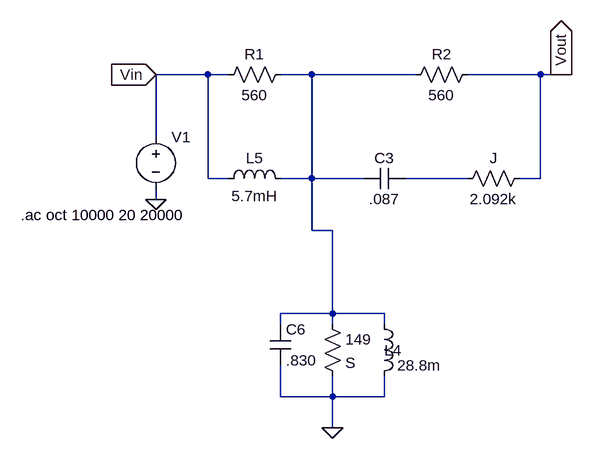
[diagram p0: schematic HiLoCut.asc]
HiLoCut.asc, the LTspice schematic file:
Version 4
SHEET 1 880 680
WIRE 192 112 112 112
WIRE 224 112 192 112
WIRE 352 112 304 112
WIRE 512 112 352 112
WIRE 704 112 592 112
WIRE 736 112 704 112
WIRE 752 112 736 112
WIRE 112 208 112 112
WIRE 192 272 192 112
WIRE 224 272 192 272
WIRE 352 272 352 112
WIRE 352 272 304 272
WIRE 432 272 352 272
WIRE 592 272 496 272
WIRE 704 272 704 112
WIRE 704 272 672 272
WIRE 112 304 112 288
WIRE 352 352 352 272
WIRE 384 352 352 352
WIRE 384 480 384 352
WIRE 384 480 304 480
WIRE 464 480 384 480
WIRE 304 496 304 480
WIRE 384 496 384 480
WIRE 464 496 464 480
WIRE 304 608 304 560
WIRE 384 608 384 576
WIRE 384 608 304 608
WIRE 464 608 464 576
WIRE 464 608 384 608
WIRE 384 656 384 608
FLAG 736 112 Vout
IOPIN 736 112 Out
FLAG 112 112 Vin
IOPIN 112 112 In
FLAG 384 656 0
FLAG 112 304 0
SYMBOL voltage 112 192 R0
SYMATTR InstName V1
SYMATTR Value ""
SYMATTR Value2 AC 1
SYMBOL Res 320 96 R90
WINDOW 0 0 56 VBottom 2
WINDOW 3 32 56 VTop 2
SYMATTR InstName R1
SYMATTR Value 560
SYMBOL Res 608 96 R90
WINDOW 0 0 56 VBottom 2
WINDOW 3 32 56 VTop 2
SYMATTR InstName R2
SYMATTR Value 560
SYMBOL Res 688 256 R90
WINDOW 0 0 56 VBottom 2
WINDOW 3 32 56 VTop 2
SYMATTR InstName J
SYMATTR Value 2.092k
SYMBOL Res 368 480 R0
WINDOW 0 36 76 Left 2
WINDOW 3 36 40 Left 2
SYMATTR InstName S
SYMATTR Value 149
SYMBOL ind 208 288 R270
WINDOW 0 32 56 VTop 2
WINDOW 3 5 56 VBottom 2
SYMATTR InstName L5
SYMATTR Value 5.7mH
SYMATTR SpiceLine Rser=51.7
SYMBOL ind 448 480 R0
WINDOW 0 16 57 Left 2
SYMATTR InstName L4
SYMATTR Value 28.8m
SYMATTR SpiceLine Rser=5.37
SYMBOL Cap 288 496 R0
SYMATTR InstName C6
SYMATTR Value .830
SYMBOL Cap 496 256 R90
WINDOW 0 0 32 VBottom 2
WINDOW 3 32 32 VTop 2
SYMATTR InstName C3
SYMATTR Value .087
TEXT -96 328 Left 2 !.ac oct 10000 20 20000

The netlist it stands for:
* HiLoCut.asc
V1 Vin 0 AC 1
R1 N001 Vin 560
R2 Vout N001 560
R§J Vout N002 2.092k
R§S N001 0 149
L5 Vin N001 5.7mH Rser=51.7
L4 N001 0 28.8m Rser=5.37
C6 N001 0 .830
C3 N002 N001 .087
.ac oct 10000 20 20000
.backanno
.end